# Altium schematic sheet PSM_components_REV_C.SchDoc: power.sch
size A3; Date: 30/04/2014 10:20:37 AM; SheetNumber: Sheet:
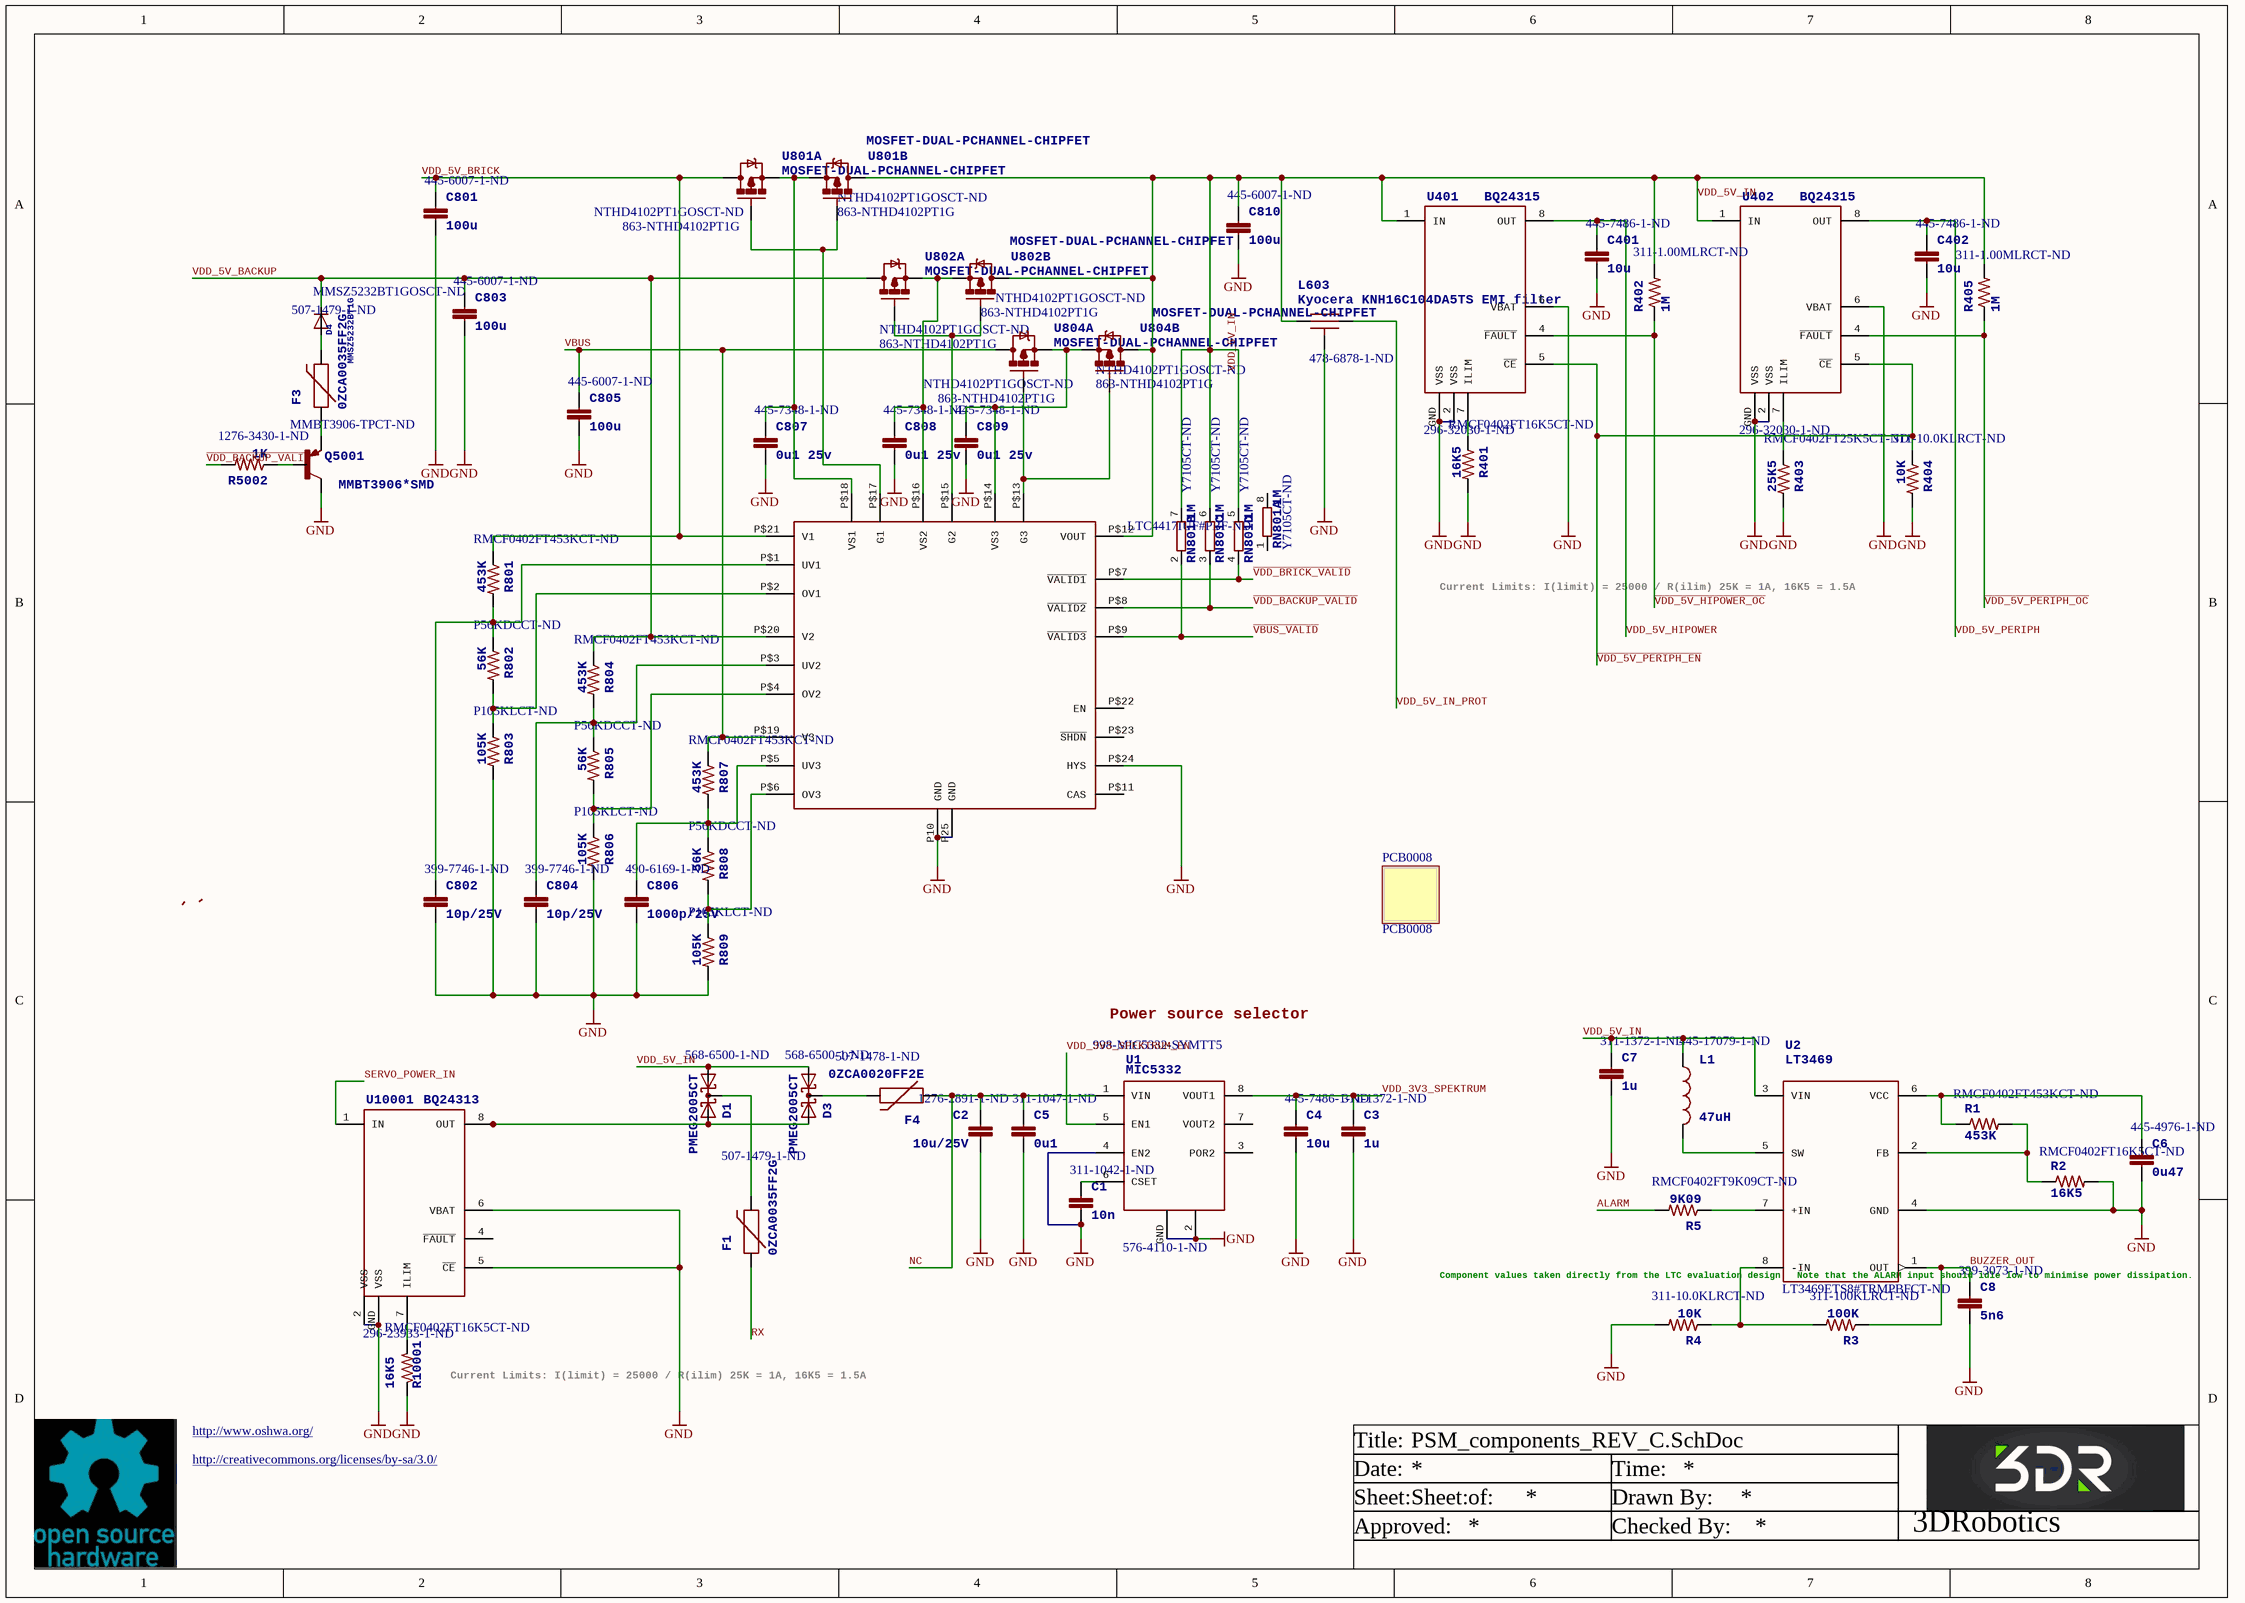
[diagram p0: PSM_components_REV_C.SchDoc]

## Parts
C1  10n  Supplier Part Number 1: 311-1042-1-ND  [0402-CAP]
C2  10u/25V  Supplier Part Number 1: 1276-2891-1-ND  [0805-CAP]
C3  1u  Supplier Part Number 1: 311-1372-1-ND  [0603-CAP]
C4  10u  Supplier Part Number 1: 445-7486-1-ND  [0603-CAP]
C5  0u1  Supplier Part Number 1: 311-1047-1-ND  [0402-CAP]
C6  0u47  Supplier Part Number 1: 445-4976-1-ND  [0402-CAP]
C7  1u  Supplier Part Number 1: 311-1372-1-ND  [0603-CAP]
C8  5n6  Supplier Part Number 1: 399-3073-1-ND  [0402-CAP]
C401  10u  Supplier Part Number 1: 445-7486-1-ND  [0603-CAP]
C402  10u  Supplier Part Number 1: 445-7486-1-ND  [0603-CAP]
C801  100u  Supplier Part Number 1: 445-6007-1-ND  [1206-CAP]
C802  10p/25V  Supplier Part Number 1: 399-7746-1-ND  [0402-CAP]
C803  100u  Supplier Part Number 1: 445-6007-1-ND  [1206-CAP]
C804  10p/25V  Supplier Part Number 1: 399-7746-1-ND  [0402-CAP]
C805  100u  Supplier Part Number 1: 445-6007-1-ND  [1206-CAP]
C806  1000p/25V  Supplier Part Number 1: 490-6169-1-ND  [0402-CAP]
C807  0u1 25v  Supplier Part Number 1: 445-7348-1-ND  [0402-CAP]
C808  0u1 25v  Supplier Part Number 1: 445-7348-1-ND  [0402-CAP]
C809  0u1 25v  Supplier Part Number 1: 445-7348-1-ND  [0402-CAP]
C810  100u  Supplier Part Number 1: 445-6007-1-ND  [1206-CAP]
D1  PMEG2005CT  Supplier Part Number 1: 568-6500-1-ND  [SOT23-3]
D3  PMEG2005CT  Supplier Part Number 1: 568-6500-1-ND  [SOT23-3]
D4  MMSZ5232BT1G  Supplier Part Number 1: MMSZ5232BT1GOSCT-ND  [SOD-123]
F1  0ZCA0035FF2G  Supplier Part Number 1: 507-1479-1-ND  [PTC-1206]
F3  0ZCA0035FF2G  Supplier Part Number 1: 507-1479-1-ND  [PTC-1206]
F4  0ZCA0020FF2E  Supplier Part Number 1: 507-1478-1-ND  [PTC-1206]
L1  47uH  Supplier Part Number 1: 445-17079-1-ND  [0805-IND]
L603  Kyocera KNH16C104DA5TS EMI filter  Supplier Part Number 1: 478-6878-1-ND  [KYOCERA-KNH16-DA]
PCB0008  PCB0008
Q5001  MMBT3906*SMD  Supplier Part Number 1: MMBT3906-TPCT-ND  [SOT23-BEC]
R1  453K  Supplier Part Number 1: RMCF0402FT453KCT-ND  [0402-RES]
R2  16K5  Supplier Part Number 1: RMCF0402FT16K5CT-ND  [0402-RES]
R3  100K  Supplier Part Number 1: 311-100KLRCT-ND  [0402-RES]
R4  10K  Supplier Part Number 1: 311-10.0KLRCT-ND  [0402-RES]
R5  9K09  Supplier Part Number 1: RMCF0402FT9K09CT-ND  [0402-RES]
R401  16K5  Supplier Part Number 1: RMCF0402FT16K5CT-ND  [0402-RES]
R402  1M  Supplier Part Number 1: 311-1.00MLRCT-ND  [0402-RES]
R403  25K5  Supplier Part Number 1: RMCF0402FT25K5CT-ND  [0402-RES]
R404  10K  Supplier Part Number 1: 311-10.0KLRCT-ND  [0402-RES]
R405  1M  Supplier Part Number 1: 311-1.00MLRCT-ND  [0402-RES]
R801  453K  Supplier Part Number 1: RMCF0402FT453KCT-ND  [0402-RES]
R802  56K  Supplier Part Number 1: P56KDCCT-ND  [0402-RES]
R803  105K  Supplier Part Number 1: P105KLCT-ND  [0402-RES]
R804  453K  Supplier Part Number 1: RMCF0402FT453KCT-ND  [0402-RES]
R805  56K  Supplier Part Number 1: P56KDCCT-ND  [0402-RES]
R806  105K  Supplier Part Number 1: P105KLCT-ND  [0402-RES]
R807  453K  Supplier Part Number 1: RMCF0402FT453KCT-ND  [0402-RES]
R808  56K  Supplier Part Number 1: P56KDCCT-ND  [0402-RES]
R809  105K  Supplier Part Number 1: P105KLCT-ND  [0402-RES]
R5002  1K  Supplier Part Number 1: 1276-3430-1-ND  [0402-RES]
R10001  16K5  Supplier Part Number 1: RMCF0402FT16K5CT-ND  [0402-RES]
RN801  1M  Supplier Part Number 1: Y7105CT-ND  [EXB28V]  (parts A,B,C,D of 4)
U1  MIC5332  Supplier Part Number 1: 576-4110-1-ND  Supplier Part Number 2: 998-MIC5332-SYMTT5  [MLF-8-EPAD]
U2  LT3469  Supplier Part Number 1: LT3469ETS8#TRMPBFCT-ND  [SOT23-8]
U401  BQ24315  Supplier Part Number 1: 296-32030-1-ND  [QFN8-DSG]
U402  BQ24315  Supplier Part Number 1: 296-32030-1-ND  [QFN8-DSG]
U801  MOSFET-DUAL-PCHANNEL-CHIPFET  Supplier Part Number 1: NTHD4102PT1GOSCT-ND  Supplier Part Number 2: 863-NTHD4102PT1G  [1206-8]  (parts A,B of 2)
U802  MOSFET-DUAL-PCHANNEL-CHIPFET  Supplier Part Number 1: NTHD4102PT1GOSCT-ND  Supplier Part Number 2: 863-NTHD4102PT1G  [1206-8]  (parts A,B of 2)
U803  Supplier Part Number 1: LTC4417IUF#PBF-ND  [MO-220]  (hidden comment: LTC4417)
U804  MOSFET-DUAL-PCHANNEL-CHIPFET  Supplier Part Number 1: NTHD4102PT1GOSCT-ND  Supplier Part Number 2: 863-NTHD4102PT1G  [1206-8]  (parts A,B of 2)
U10001  BQ24313  Supplier Part Number 1: 296-23933-1-ND  [QFN8-DSG]

## Nets
GND: C1.P$2 C2.P$2 C3.P$2 C4.P$2 C5.P$2 C6.P$2 C7.P$2 C8.P$2 C401.P$2 C402.P$2 C801.P$2 C802.P$2 C803.P$2 C804.P$2 C805.P$2 C806.P$2 C807.P$2 C808.P$2 C809.P$2 C810.P$2 L603.GND Q5001.C R2.P$2 R4.P$2 R401.P$2 R403.P$2 R404.P$2 R803.P$2 R806.P$2 R809.P$2 R10001.P$1 U1.2(GND) U1.4(EN2) U1.GND U2.4(GND) U401.2(VSS) U401.6(VBAT) U401.GND(VSS) U402.2(VSS) U402.6(VBAT) U402.GND(VSS) U803.P10(GND) U803.P25(GND) U803.P$24(HYS) U10001.2(VSS) U10001.5(~{CE}) U10001.6(VBAT) U10001.GND(VSS)
ALARM: R5.P$2
BUZZER_OUT: C8.P$1 R3.P$1 U2.1(OUT)
NC: C2.P$1 C5.P$1 F4.1 U1.1(VIN)
RX: F1.1
SERVO_POWER_IN: U10001.1(IN)
~{VBUS_VALID}: RN801.2 U803.P$9(~{VALID3})
~{VDD_5V_HIPOWER_OC}: R402.P$1 U401.4(~{FAULT})
~{VDD_5V_PERIPH_EN}: R404.P$1 U401.5(~{CE}) U402.5(~{CE})
~{VDD_5V_PERIPH_OC}: R405.P$1 U402.4(~{FAULT})
~{VDD_BACKUP_VALID}: R5002.P$2 RN801.3 U803.P$8(~{VALID2})
~{VDD_BRICK_VALID}: RN801.4 U803.P$7(~{VALID1})
VBUS: C805.P$1 R807.P$1 U803.P$19(V3) U804.P7(D)
VDD_3V3_SPEKTRUM: C3.P$1 C4.P$1 U1.8(VOUT1)
VDD_3V3_SPEKTRUM_EN: U1.5(EN1)
VDD_5V_BACKUP: C803.P$1 D4.C R804.P$1 U802.P7(D) U803.P$20(V2)
VDD_5V_BRICK: C801.P$1 R801.P$1 U801.P7(D) U803.P$21(V1)
VDD_5V_HIPOWER: C401.P$1 U401.8(OUT)
VDD_5V_IN: C7.P$1 C810.P$1 D1.1(A1) D3.1(A1) L1.P$1 L603.P$1 R402.P$2 R405.P$2 RN801.5 RN801.6 RN801.7 U2.3(VIN) U401.1(IN) U402.1(IN) U801.P5(D) U802.P5(D) U803.P$12(VOUT) U804.P5(D)
VDD_5V_IN_PROT: L603.P$2
VDD_5V_PERIPH: C402.P$1 U402.8(OUT)
NetC1_P$1: C1.P$1 U1.6(CSET)
NetC6_P$1: C6.P$1 R1.P$1 U2.6(VCC)
NetC802_P$1: C802.P$1 R801.P$2 R802.P$1 U803.P$1(UV1)
NetC804_P$1: C804.P$1 R804.P$2 R805.P$1 U803.P$3(UV2)
NetC806_P$1: C806.P$1 R807.P$2 R808.P$1 U803.P$5(UV3)
NetC807_P$1: C807.P$1 U801.P1(S) U801.P3(S) U803.P$18(VS1)
NetC808_P$1: C808.P$1 U802.P1(S) U802.P3(S) U803.P$16(VS2)
NetC809_P$1: C809.P$1 U803.P$14(VS3) U804.P1(S) U804.P3(S)
NetD1_2: D1.2(A2) D3.2(A2) U10001.8(OUT)
NetD1_3: D1.3(CC) F1.2
NetD3_3: D3.3(CC) F4.2
NetD4_A: D4.A F3.2
NetF3_1: F3.1 Q5001.E
NetL1_P$2: L1.P$2 U2.5(SW)
NetQ5001_B: Q5001.B R5002.P$1
NetR1_P$2: R1.P$2 R2.P$1 U2.2(FB)
NetR3_P$2: R3.P$2 R4.P$1 U2.8(-IN)
NetR5_P$1: R5.P$1 U2.7(+IN)
NetR401_P$1: R401.P$1 U401.7(ILIM)
NetR403_P$1: R403.P$1 U402.7(ILIM)
NetR802_P$2: R802.P$2 R803.P$1 U803.P$2(OV1)
NetR805_P$2: R805.P$2 R806.P$1 U803.P$4(OV2)
NetR808_P$2: R808.P$2 R809.P$1 U803.P$6(OV3)
NetR10001_P$2: R10001.P$2 U10001.7(ILIM)
NetU801_P2: U801.P2(G) U801.P4(G) U803.P$17(G1)
NetU802_P2: U802.P2(G) U802.P4(G) U803.P$15(G2)
NetU803_P$13: U803.P$13(G3) U804.P2(G) U804.P4(G)

Not connected (* = marked no-connect by the designer): RN801 1 8(2); U1 3(POR2) 7(VOUT2); U803 P$11(CAS) P$22(EN) P$23(~{SHDN}); U10001 4(~{FAULT})

## Notes on the sheet
- Current Limits:
  I(limit) = 25000 / R(ilim)
  25K = 1A, 16K5 = 1.5A
- Power source selector
- (near U2) Component values taken directly from
  the LTC evaluation design.
  Note that the ALARM input should idle
  low to minimise power dissipation.
- (near R10001) Current Limits:
  I(limit) = 25000 / R(ilim)
  25K = 1A, 16K5 = 1.5A
- http://www.oshwa.org/
- http://creativecommons.org/licenses/by-sa/3.0/
- Title:
- Date:
- Time:
- Sheet:
- Approved:
- of:
- Drawn By:
- Checked By:
- 3DRobotics

## Library data of the parts
C1 = CAP0402: CAP CER 10000PF 16V 10% X7R 0402; PARTNO: CC0402KRX7R7BB103; 3DR_PARTNO: ECM0711; Supplier 1: Digi-Key; Value: 10N
C2 = CAP0805: CAP CER 10UF 25V 10% X5R 0805; PARTNO: CL21A106KAYNNNE; 3DR_PARTNO: ECM0714; Supplier 1: Digi-Key; Value: 10UF
C3 C7 = CAP0603: CAP CER 1UF 16V Y5V 0603; PARTNO: CC0603ZRY5V7BB105; 3DR_PARTNO: ECM0705; Supplier 1: Digi-Key; Value: 1U
C4 C401 C402 = CAP0603: CAP CER 10UF 10V 10% X5R 0603; PARTNO: C1608X5R1A106K080AC; 3DR_PARTNO: ECM0712; Supplier 1: Digi-Key; Value: 10U
C5 = CAP0402: CAP CER 0.1UF 16V Y5V 0402; PARTNO: CC0402ZRY5V7BB104; 3DR_PARTNO: ECM0700; Supplier 1: Digi-Key; Value: 0U1
C6 = CAP0402: CAP CER 0.47UF 16V 10% X5R 0402; PARTNO: C1005X5R1C474K050BC; 3DR_PARTNO: ECM0704; Supplier 1: Digi-Key; Value: 0U47
C8 = CAP0402: CAP CER 5600PF 50V 10% X7R 0402; PARTNO: C0402C562K5RACTU; 3DR_PARTNO: ECM0535; Supplier 1: Digi-Key; Value: 5N6
C801 C803 C805 C810 = CAP1206: CAP CER 100UF 10V 20% X5R 1206; PARTNO: C3216X5R1A107M160AC; 3DR_PARTNO: ECM0716; Supplier 1: Digi-Key; Value: 100U
C802 C804 = CAP0402: CAP CER 10PF 25V 5% NP0 0402; PARTNO: C0402C100J3GACTU; 3DR_PARTNO: ECM0718; Value: 10P; Supplier 1: Digi-Key
C806 = CAP0402: CAP CER 1000PF 25V 5% NP0 0402; PARTNO: GRM1555C1E102JA01D; 3DR_PARTNO: ECM0717; Value: 1000P; Supplier 1: Digi-Key
C807-C809 = CAP0402: CAP CER 0.1UF 25V 10% X7R 0402; PARTNO: C1005X7R1E104K050BB; 3DR_PARTNO: ECM0701; Supplier 1: Digi-Key; Value: 0U1
D1 D3 = PMEG2005CT: DIODE SCHOTTKY 20V 500MA TO236AB; 3DR_PARTNO: ECM0838; PARTNO: PMEG2005CT; Supplier 1: Digi-Key; Value: 20V
D4 = DIODESOD-123: DIODE ZENER 5.6V 500MW SOD123; 3DR_PARTNO: ECM0536; Supplier 1: Digi-Key; Value: 5.6V
F1 F3 = PTCSMD: PTC RESTTBLE 0.35A 16V CHIP 1206; 3DR_PARTNO: ECM0802; PARTNO: 0ZCA0035FF2G; Supplier 1: Digi-Key; Value: 0.35A
F4 = PTCSMD: PTC RESTTBLE 0.20A 30V CHIP 1206; 3DR_PARTNO: ECM0537; Value: 0.2A; PARTNO: 0ZCA0020FF2E; Supplier 1: Digi-Key
L1 = INDUCTOR0805: FIXED IND 47UH 170MA 4.81 OHM; PARTNO: MLZ2012M470W; 3DR_PARTNO: ECM0814; Supplier 1: Digi-Key; Value: 47UH
L603 = KNH16C104DA5TS: FILTER CAP 0.1UF 2A 25V 0603; 3DR_PARTNO: ECM0719; Value: 0U1; Supplier 1: Digi-Key; PARTNO: KNH16C104DA5TS
PCB0008 = PCB_0008: 3DR_PARTNO: PCB0008; Value: PCB0008
Q5001 = MMBT3906*SMD: TRANS SS PNP 40V 300MW SOT23; 3DR_PARTNO: ECM0539; Supplier 1: Digi-Key; Value: 40V
R1 R801 R804 R807 = RESISTOR0402-RES: RES 453K OHM 1/16W 1% 0402; PARTNO: RMCF0402FT453K; 3DR_PARTNO: ECM0822; Supplier 1: Digi-Key; Value: 453K
R2 R401 = RESISTOR0402-RES: RES 16.5K OHM 1/16W 1% 0402; PARTNO: RMCF0402FT16K5; 3DR_PARTNO: ECM0812; Supplier 1: Digi-Key; Value: 16K5
R3 = RESISTOR0402-RES: RES 100K OHM 1/16W 1% 0402 SMD; PARTNO: RC0402FR-07100KL; 3DR_PARTNO: ECM0818; Supplier 1: Digi-Key; Value: 100K
R4 R404 = RESISTOR0402-RES: RES 10K OHM 1/16W 1% 0402 SMD; PARTNO: RC0402FR-0710KL; 3DR_PARTNO: ECM0800; Supplier 1: Digi-Key; Value: 10K
R5 = RESISTOR0402-RES: RES 9.09K OHM 1/16W 1% 0402; PARTNO: RMCF0402FT9K09; 3DR_PARTNO: ECM0540; Supplier 1: Digi-Key; Value: 9K09
R402 R405 = RESISTOR0402-RES: RES 1M OHM 1/16W 1% 0402 SMD; PARTNO: RC0402FR-071ML; 3DR_PARTNO: ECM0806; Supplier 1: Digi-Key; Value: 1M
R403 = RESISTOR0402-RES: RES 25.5K OHM 1/16W 1% 0402; PARTNO: RMCF0402FT25K5; 3DR_PARTNO: ECM0813; Supplier 1: Digi-Key; Value: 25K5
R802 R805 R808 = RESISTOR0402-RES: RES 56K OHM 1/16W .1% 0402 SMD; PARTNO: ERA-2AEB563X; 3DR_PARTNO: ECM0815; Value: 5.6K; Supplier 1: Digi-Key
R803 R806 R809 = RESISTOR0402-RES: RES 105K OHM 1/10W 1% 0402 SMD; PARTNO: ERJ-2RKF1053X; 3DR_PARTNO: ECM0819; Supplier 1: Digi-Key; Value: 105K
R5002 = RESISTOR0402-RES: RES 1K OHM 1/16W 1% 0402; PARTNO: RC1005F102CS; 3DR_PARTNO: ECM0804; Supplier 1: Digi-Key; Value: 1K
R10001 = RESISTOR0402-RES: RES 16.5K OHM 1/16W 1% 0402; 3DR_PARTNO: ECM0812; Supplier 1: Digi-Key; Value: 16K5
RN801 = 4R-NEXB28V: RES ARRAY 1M OHM 4 RES 0804; PARTNO: EXB-28V105JX; 3DR_PARTNO: ECM0805; OC_FARNELL: unknown; OC_NEWARK: unknown; Supplier 1: Digi-Key; Value: 1M
U1 = MIC5332: IC REG LDO 3.3V 0.3A 8TMLF; 3DR_PARTNO: ECM0832; Supplier 1: Digi-Key; Supplier 2: Mouser; Value: 3.3V
U2 = LT3469: IC AMP DVR W/REG 1.3MHZ TSOT23-8; 3DR_PARTNO: ECM0829; Value: BUZZER; Supplier 1: Digi-Key
U401 U402 = BQ24315: IC LI+ CHARGER FRONT END 8SON; 3DR_PARTNO: ECM0541; Value: 3.3V-30V; Supplier 1: Digi-Key
U801 U802 U804 = MOSFET-DUAL-PCHANNEL-CHIPFET: MOSFET 2P-CH 20V 2.9A CHIPFET; 3DR_PARTNO: EMC0901; Supplier 1: Digi-Key; Supplier 2: Mouser; Value: 20V 2.9A
U803 = LTC4117: IC OR CTRLR SRC SELECT 24QFN; 3DR_PARTNO: ECM0830; Value: 3:1; Supplier 1: Digi-Key
U10001 = BQ24313: IC LI+ CHARGER FRONT END 8-SON; 3DR_PARTNO: ECM0824; Value: 3.3V-30V; Supplier 1: Digi-Key